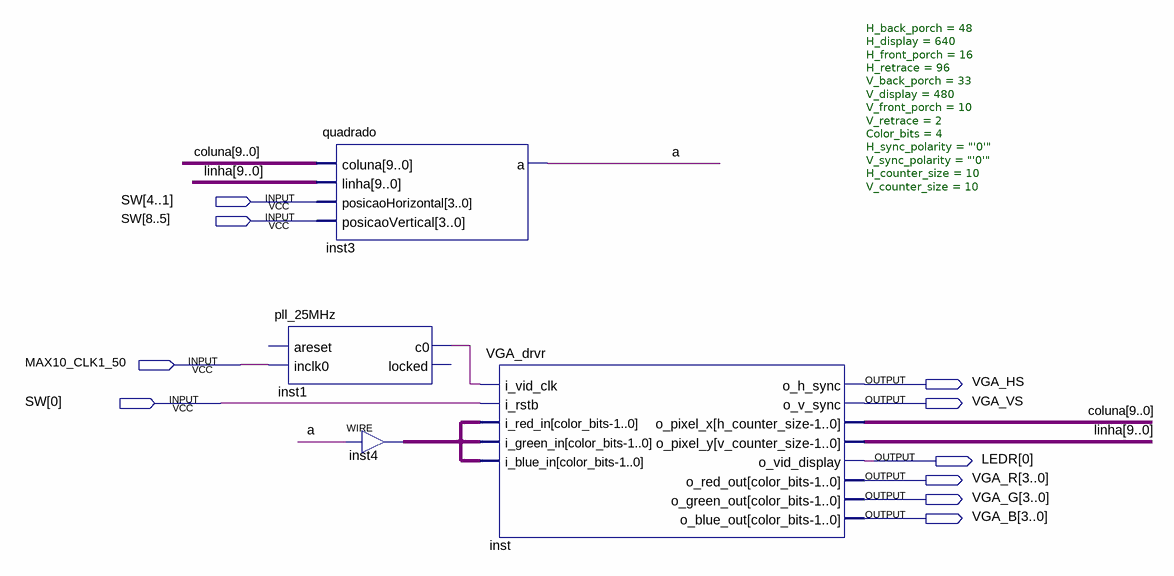
[diagram p0: schematic sheet]
// Quartus schematic vga1.bdf as structural Verilog: 4 symbols, 10 pins
module vga1 (
  input  [8:0] SW,
  input  MAX10_CLK1_50,
  output VGA_HS,
  output VGA_VS,
  output [0:0] LEDR,
  output [3:0] VGA_R,
  output [3:0] VGA_G,
  output [3:0] VGA_B
);

  wire a, inst1_c0;
  wire [3:0] inst4_out;
  wire [9:0] coluna, linha;

  pll_25MHz inst1 (.inclk0(MAX10_CLK1_50), .c0(inst1_c0));  // open: areset, locked
  quadrado inst3 (.coluna(coluna), .linha(linha), .posicaoHorizontal(SW[4:1]), .posicaoVertical(SW[8:5]), .a(a));
  assign inst4_out = {4{a}};  // WIRE inst4
  VGA_drvr #(.H_back_porch(48), .H_display(640), .H_front_porch(16), .H_retrace(96), .V_back_porch(33), .V_display(480), .V_front_porch(10), .V_retrace(2), .Color_bits(4), .H_sync_polarity("'0'"), .V_sync_polarity("'0'"), .H_counter_size(10), .V_counter_size(10)) inst (
    .i_vid_clk(inst1_c0), .i_rstb(SW[0]), .i_red_in(inst4_out), .i_green_in(inst4_out),
    .i_blue_in(inst4_out), .o_h_sync(VGA_HS), .o_v_sync(VGA_VS), .o_pixel_x(coluna), .o_pixel_y(linha),
    .o_vid_display(LEDR[0]), .o_red_out(VGA_R), .o_green_out(VGA_G), .o_blue_out(VGA_B));
endmodule
